# Altium schematic sheet R3S601.SchDoc
size A3
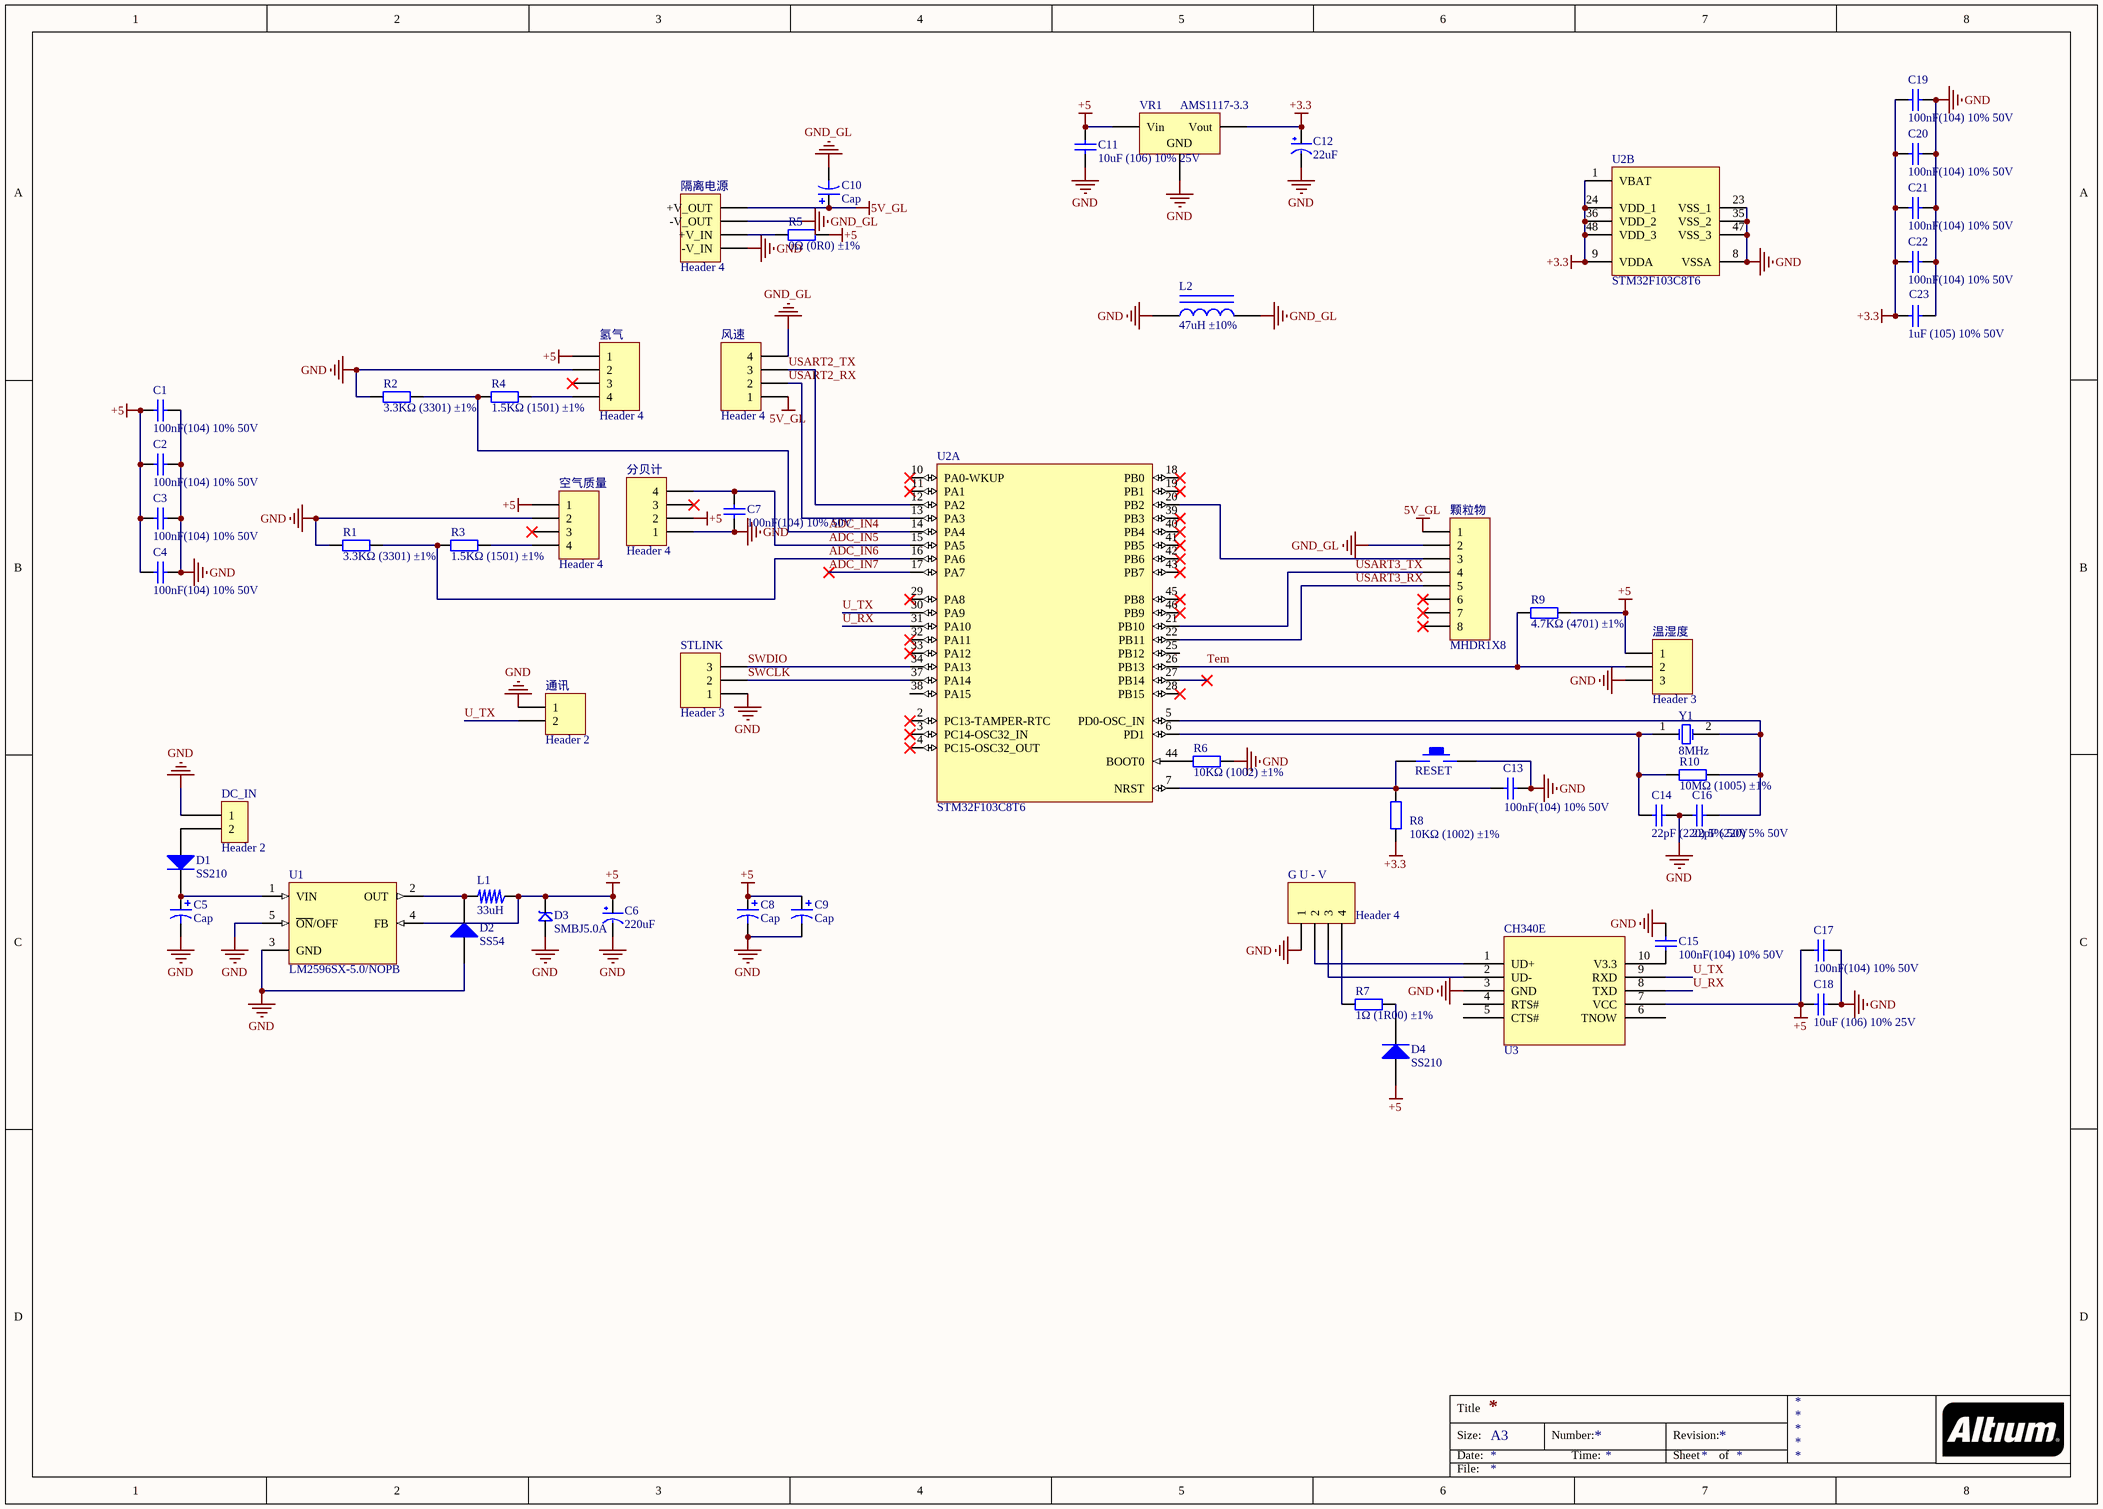
[diagram p0: R3S601.SchDoc]

## Parts
C1  100nF(104) 10% 50V  [LC-0805_C]
C2  100nF(104) 10% 50V  [LC-0805_C]
C3  100nF(104) 10% 50V  [LC-0805_C]
C4  100nF(104) 10% 50V  [LC-0805_C]
C5  Cap  [CAP-DIP-3.5]
C6  220uF  [CC6.56.5]
C7  100nF(104) 10% 50V  [LC-0805_C]
C8  Cap  [CAP-DIP-3.5]
C9  Cap  [CAP-DIP-5.0]
C10  Cap  [CAP-DIP-3.5]
C11  10uF (106) 10% 25V  [LC-0805_C]
C12  22uF  [CC6.56.5]
C13  100nF(104) 10% 50V  [LC-0805_C]
C14  22pF (220) 5% 50V  [LC-0805_C]
C15  100nF(104) 10% 50V  [LC-0805_C]
C16  22pF (220) 5% 50V  [LC-0805_C]
C17  100nF(104) 10% 50V  [LC-0805_C]
C18  10uF (106) 10% 25V  [LC-0805_C]
C19  100nF(104) 10% 50V  [LC-0805_C]
C20  100nF(104) 10% 50V  [LC-0805_C]
C21  100nF(104) 10% 50V  [LC-0805_C]
C22  100nF(104) 10% 50V  [LC-0805_C]
C23  1uF (105) 10% 50V  [LC-0805_C]
D1  SS210  [LC-SMA(DO-214AC)_S1]
D2  SS54  [LC-SMA(DO-214AC)_S1]
D3  SMBJ5.0A  [SMBJ]
D4  SS210  [LC-SMA(DO-214AC)_S1]
DC_IN  Header 2  [VH-2A - Circle Hole]
G_U_-_V  Header 4  [HDR1X4]
L1  33uH  [L_SOP74]
L2  47uH ±10%  [LC-0805_L]
R1  3.3KΩ (3301) ±1%  [LC-0805_R]
R2  3.3KΩ (3301) ±1%  [LC-0805_R]
R3  1.5KΩ (1501) ±1%  [LC-0805_R]
R4  1.5KΩ (1501) ±1%  [LC-0805_R]
R5  0Ω (0R0) ±1%  [LC-0603_R]
R6  10KΩ (1002) ±1%  [LC-0805_R]
R7  1Ω (1R00) ±1%  [LC-0603_R]
R8  10KΩ (1002) ±1%  [LC-0805_R]
R9  4.7KΩ (4701) ±1%  [LC-0805_R]
R10  10MΩ (1005) ±1%  [LC-0805_R]
RESET  KEY_M  [KEY_M]  (value not drawn)
STLINK  Header 3  [HDR1X3]
U1  LM2596SX-5.0/NOPB  [LC-TO-263-5]
U2  STM32F103C8T6  [LC-LQFP-48_7x7x05P]  (parts A,B of 2)
U3  CH340E  [LC-MSOP-10]  (value not drawn)
VR1  AMS1117-3.3  [LC-SOT-223]
Y1  8MHz  [XTAL_US]
分贝计  Header 4  [HDR1X4]
氢气  Header 4  [HDR1X4]
温湿度  Header 3  [HDR1X3]
空气质量  Header 4  [HDR1X4]
通讯  Header 2  [HDR1X2]
隔离电源  Header 4  [HDR1X4]
颗粒物  MHDR1X8  [MHDR1X8]
风速  Header 4  [HDR1X4]

## Nets
5V_GL: C10.1 隔离电源.4(+V_OUT) 颗粒物.1 风速.1
+3.3: C12.1(VCC) C19.2 C20.2 C21.2 C22.2 C23.2 R8.1 U2.1(VBAT) U2.9(VDDA) U2.24(VDD_1) U2.36(VDD_2) U2.48(VDD_3) VR1.2(Vout)
+5: C1.1 C2.1 C3.1 C4.1 C6.1(VCC) C8.1 C9.1 C11.2 C17.1 C18.1 D3.2 D4.1(A) L1.1 R5.2 R9.2 U1.4(FB) U3.7(VCC) VR1.3(Vin) 分贝计.2 氢气.1 温湿度.1 空气质量.1
GND: C1.2 C2.2 C3.2 C4.2 C5.2 C6.2(GND) C7.1 C8.2 C9.2 C11.1 C12.2(GND) C13.1 C14.2 C15.2 C16.1 C17.2 C18.2 C19.1 C20.1 C21.1 C22.1 C23.1 D2.1(A) D3.1 DC_IN.1 G_U_-_V.1 L2.1 R1.1 R2.1 R6.2 RESET.2 STLINK.1 U1.3(GND) U1.5(~{ON}/OFF) U2.8(VSSA) U2.23(VSS_1) U2.35(VSS_2) U2.47(VSS_3) U3.3(GND) VR1.1(GND) 分贝计.1 氢气.2 温湿度.3 空气质量.2 通讯.1 隔离电源.1(-V_IN)
GND_GL: C10.2 L2.2 隔离电源.3(-V_OUT) 颗粒物.2 风速.4
ADC_IN4: R2.2 R4.1 U2.14(PA4)
ADC_IN5: C7.2 U2.15(PA5) 分贝计.4
ADC_IN6: R1.2 R3.1 U2.16(PA6)
ADC_IN7: U2.17(PA7)
SWCLK: STLINK.2 U2.37(PA14)
SWDIO: STLINK.3 U2.34(PA13)
Tem: R9.1 U2.26(PB13) 温湿度.2
U_RX: U2.31(PA10) U3.8(TXD)
U_TX: U2.30(PA9) U3.9(RXD) 通讯.2
USART2_RX: U2.13(PA3) 风速.2
USART2_TX: U2.12(PA2) 风速.3
USART3_RX: U2.22(PB11) 颗粒物.5
USART3_TX: U2.21(PB10) 颗粒物.4
NetC5_1: C5.1 D1.2(K) U1.1(VIN)
NetC13_2: C13.2 R8.2 RESET.1 U2.7(NRST)
NetC14_1: C14.1 R10.1 U2.6(PD1) Y1.1(OSC1)
NetC15_1: C15.1 U3.10(V3.3)
NetC16_2: C16.2 R10.2 U2.5(PD0-OSC_IN) Y1.2(OSC2)
NetD1_1: D1.1(A) DC_IN.2
NetD2_2: D2.2(K) L1.2 U1.2(OUT)
NetD4_2: D4.2(K) R7.2
NetG_U_-_V_2: G_U_-_V.2 U3.1(UD+)
NetG_U_-_V_3: G_U_-_V.3 U3.2(UD-)
NetG_U_-_V_4: G_U_-_V.4 R7.1
NetR3_2: R3.2 空气质量.4
NetR4_2: R4.2 氢气.4
NetR5_1: R5.1 隔离电源.2(+V_IN)
NetR6_1: R6.1 U2.44(BOOT0)
NetU2_20: U2.20(PB2) 颗粒物.3

Not connected (* = marked no-connect by the designer): U2 2(PC13-TAMPER-RTC)* 3(PC14-OSC32_IN)* 4(PC15-OSC32_OUT)* 10(PA0-WKUP)* 11(PA1)* 18(PB0)* 19(PB1)* 25(PB12) 27(PB14)* 28(PB15)* 29(PA8)* 32(PA11)* 33(PA12)* 38(PA15) 39(PB3)* 40(PB4)* 41(PB5)* 42(PB6)* 43(PB7)* 45(PB8)* 46(PB9)*; U3 4(RTS#) 5(CTS#) 6(TNOW); 分贝计 3*; 氢气 3*; 空气质量 3*; 颗粒物 6* 7* 8*

## Notes on the sheet
- Title
- Size:
- Date:
- A3
- Number:
- Time:
- Revision:
- Sheet
- of
- File:

## Library data of the parts
C1-C4 C7 C13 C15 C17 C19-C22 = 0805 100nF(104) 10% 50V: 贴片电容; ComponentLink1Description: 供应商链接; ComponentLink1URL: http://www.szlcsc.com/product/details_50686.html; Package: 0805; Supplier: LC; SuppliersPartNumber: C49678
C5 C8-C10 = Cap_DIP
C6 C12 = CAP
C11 C18 = 0805 10uF (106) 10% 25V: 贴片电容; ComponentLink1Description: 供应商链接; ComponentLink1URL: http://www.szlcsc.com/product/details_16532.html; Package: 0805; Supplier: LC; SuppliersPartNumber: C15850
C14 C16 = 0805 22pF (220) 5% 50V: 贴片电容; ComponentLink1Description: 供应商链接; ComponentLink1URL: http://www.szlcsc.com/product/details_2156.html; Package: 0805; Supplier: LC; SuppliersPartNumber: C1804
C23 = 0805 1uF (105) 10% 50V: 贴片电容; ComponentLink1Description: 供应商链接; ComponentLink1URL: http://www.szlcsc.com/product/details_29074.html; Package: 0805; Supplier: LC; SuppliersPartNumber: C28323
D1 D4 = SMA(DO-214AC) SS210: 二极管; ComponentLink1Description: 供应商链接; ComponentLink1URL: http://www.szlcsc.com/product/details_15669.html; Package: SMA(DO-214AC); Supplier: LC; SuppliersPartNumber: C14996
D2 = SMA(DO-214AC) SS54: 二极管; ComponentLink1Description: 供应商链接; ComponentLink1URL: http://www.szlcsc.com/product/details_23178.html; Package: SMA(DO-214AC); Supplier: LC; SuppliersPartNumber: C22452
D3 = SMBJ: TVS
DC_IN = Header 2: 贴片2p座
G_U_-_V 分贝计 氢气 空气质量 隔离电源 风速 = Header 4: Header, 4-Pin; LatestRevisionDate: 17-Jul-2002; LatestRevisionNote: Re-released for DXP Platform.; Publisher: Altium Limited
L1 = L_SOP
L2 = 0805 47uH 10%: 贴片电感; ComponentLink1Description: 供应商链接; ComponentLink1URL: http://www.szlcsc.com/product/details_14964.html; Package: 0805; Supplier: LC; SuppliersPartNumber: C14304
R1 R2 = 0805 3.3KΩ (3301) 1%: 贴片电阻; ComponentLink1Description: 供应商链接; ComponentLink1URL: http://www.szlcsc.com/product/details_26753.html; Package: 0805; Supplier: LC; SuppliersPartNumber: C26010
R3 R4 = 0805 1.5KΩ (1501) 1%: 贴片电阻; ComponentLink1Description: 供应商链接; ComponentLink1URL: http://www.szlcsc.com/product/details_4717.html; Package: 0805; Supplier: LC; SuppliersPartNumber: C4310
R5 = 0603 0Ω (0R0) 1%: 贴片电阻; ComponentLink1Description: 供应商链接; ComponentLink1URL: http://www.szlcsc.com/product/details_21903.html; Package: 0603; Supplier: LC; SuppliersPartNumber: C21189
R6 R8 = 0805 10KΩ (1002) 1%: 贴片电阻; ComponentLink1Description: 供应商链接; ComponentLink1URL: http://www.szlcsc.com/product/details_18102.html; Package: 0805; Supplier: LC; SuppliersPartNumber: C17414
R7 = 0603 1Ω (1R00) 1%: 贴片电阻; ComponentLink1Description: 供应商链接; ComponentLink1URL: http://www.szlcsc.com/product/details_23663.html; Package: 0603; Supplier: LC; SuppliersPartNumber: C22936
R9 = 0805 4.7KΩ (4701) 1%: 贴片电阻; ComponentLink1Description: 供应商链接; ComponentLink1URL: http://www.szlcsc.com/product/details_18361.html; Package: 0805; Supplier: LC; SuppliersPartNumber: C17673
R10 = 0805 10MΩ (1005) 1%: 贴片电阻; ComponentLink1Description: 供应商链接; ComponentLink1URL: http://www.szlcsc.com/product/details_26851.html; Package: 0805; Supplier: LC; SuppliersPartNumber: C26108
STLINK 温湿度 = Header 3: Header, 3-Pin; LatestRevisionDate: 17-Jul-2002; LatestRevisionNote: Re-released for DXP Platform.; Publisher: Altium Limited
U1 = LM2596SX-5.0/NOPB: DC-DC芯片; ComponentLink1Description: 供应商链接; ComponentLink1URL: http://www.szlcsc.com/product/details_10538.html; Package: TO-263-5; Supplier: LC; SuppliersPartNumber: C10002
U2 = STM32F103C8T6: ARM; ComponentLink1Description: 供应商链接; ComponentLink1URL: http://www.szlcsc.com/product/details_9243.html; Package: LQFP-48_7x7x05P; Supplier: LC; SuppliersPartNumber: C8734
U3 = CH340E: USB; ComponentLink1Description: 供应商链接; ComponentLink1URL: http://www.szlcsc.com/product/details_14927.html; Package: SOIC-16_150mil; Supplier: LC; SuppliersPartNumber: C14267
VR1 = SOT-223 AMS1117-3.3: 低压差线性稳压(LDO); ComponentLink1Description: 供应商链接; ComponentLink1URL: http://www.szlcsc.com/product/details_6652.html; Package: SOT-223; Supplier: LC; SuppliersPartNumber: C6186
Y1 = XTAL: Crystal Oscillator; Published: 8-Jun-2000; LatestRevisionDate: 17-Jul-2002; LatestRevisionNote: Re-released for DXP Platform.; Publisher: Altium Limited
通讯 = Header 2: Header, 2-Pin; LatestRevisionDate: 17-Jul-2002; LatestRevisionNote: Re-released for DXP Platform.; Publisher: Altium Limited
颗粒物 = MHDR1X8: Header, 8-Pin; LatestRevisionDate: 17-Jul-2002; LatestRevisionNote: Re-released for DXP Platform.; Publisher: Altium Limited